# Altium schematic sheet sumo.SchDoc
size A4
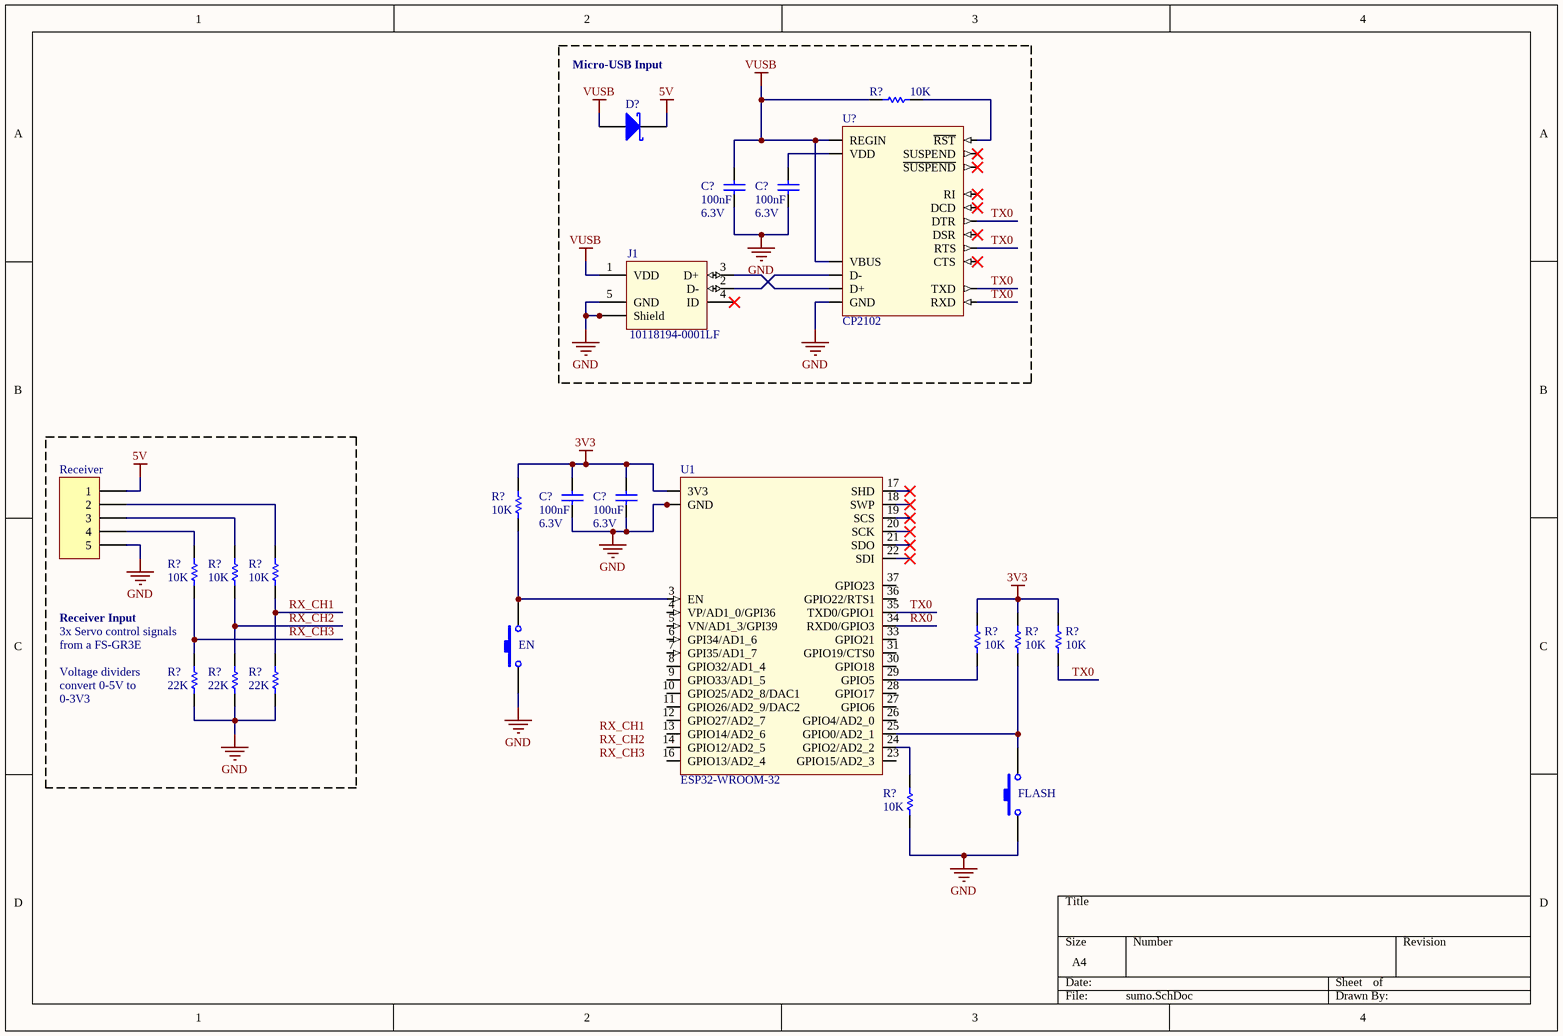
[diagram p0: sumo.SchDoc]

## Parts
(Parts that share a designator on the sheet are numbered #1, #2 ... from top to bottom, then left to right.)
C?#1  value 100nF  Voltage Rating: 6.3V  (hidden comment: Cap)
C?#2  value 100nF  Voltage Rating: 6.3V  (hidden comment: Cap)
C?#3  value 100nF  Voltage Rating: 6.3V  (hidden comment: Cap)
C?#4  value 100uF  Voltage Rating: 6.3V  (hidden comment: Cap)
D?  D Schottky  [SS14]  (value not drawn)
EN  SW-PB  [K2-1107ST-A4SW-06]  (value not drawn)
FLASH  SW-PB  [K2-1107ST-A4SW-06]  (value not drawn)
J1  10118194-0001LF  [10103594-0001LF]
R?#1  value 10K  [J1-0603]  (hidden comment: Res1)
R?#2  value 10K  [J1-0603]  (hidden comment: Res1)
R?#3  value 10K  [J1-0603]  (hidden comment: Res1)
R?#4  value 10K  [J1-0603]  (hidden comment: Res1)
R?#5  value 10K  [J1-0603]  (hidden comment: Res1)
R?#6  value 10K  [J1-0603]  (hidden comment: Res1)
R?#7  value 10K  [J1-0603]  (hidden comment: Res1)
R?#8  value 10K  [J1-0603]  (hidden comment: Res1)
R?#9  value 22K  [J1-0603]  (hidden comment: Res1)
R?#10  value 22K  [J1-0603]  (hidden comment: Res1)
R?#11  value 22K  [J1-0603]  (hidden comment: Res1)
R?#12  value 10K  [J1-0603]  (hidden comment: Res1)
Receiver  (no value)  [HDR1X5]
U1  ESP32-WROOM-32  [ESP32-WROOM-32]
U?  CP2102  [QFN-28]

## Blocks framed on the sheet
Micro-USB Input: C?#1 C?#2 D? J1 R?#1 U?

## Nets
3V3: C?#3.2 C?#4.2 R?#2.2 R?#6.2 R?#7.2 R?#8.2 U1.2(3V3)
5V: D?.2(K) Receiver.1
GND: C?#1.1 C?#2.1 C?#3.1 C?#4.1 EN.1 FLASH.1 J1.5(GND) J1.6(Shield) J1.7(Shield) J1.8(Shield) J1.9(Shield) R?#9.1 R?#10.1 R?#11.1 R?#12.1 Receiver.5 U1.1(GND) U1.15(GND) U1.38(GND) U1.39(GND) U?.3(GND)
VUSB: C?#1.2 D?.1(A) J1.1(VDD) R?#1.2 U?.7(REGIN) U?.8(VBUS)
RX0: U1.34(RXD0/GPIO3)
RX_CH1: R?#5.1 R?#11.2
RX_CH2: R?#4.1 R?#10.2
RX_CH3: R?#3.1 R?#9.2
TX0: R?#8.1 U1.35(TXD0/GPIO1) U?.24(RTS) U?.25(RXD) U?.26(TXD) U?.28(DTR)
NetC?#2_2: C?#2.2 U?.6(VDD)
NetEN_2: EN.2 R?#2.1 U1.3(EN)
NetFLASH_2: FLASH.2 R?#7.1 U1.25(GPIO0/AD2_1)
NetJ1_2: J1.2(D-) U?.5(D-)
NetJ1_3: J1.3(D+) U?.4(D+)
NetR?#1_1: R?#1.1 U?.9(~{RST})
NetR?#3_2: R?#3.2 Receiver.4
NetR?#4_2: R?#4.2 Receiver.3
NetR?#5_2: R?#5.2 Receiver.2
NetR?#6_1: R?#6.1 U1.29(GPIO5)
NetR?#12_2: R?#12.2 U1.24(GPIO2/AD2_2)

Not connected (* = marked no-connect by the designer): J1 4(ID)*; U1 4(VP/AD1_0/GPI36) 5(VN/AD1_3/GPI39) 6(GPI34/AD1_6) 7(GPI35/AD1_7) 8(GPIO32/AD1_4) 9(GPIO33/AD1_5) 10(GPIO25/AD2_8/DAC1) 11(GPIO26/AD2_9/DAC2) 12(GPIO27/AD2_7) 13(GPIO14/AD2_6) 14(GPIO12/AD2_5) 16(GPIO13/AD2_4) 17(SHD)* 18(SWP)* 19(SCS)* 20(SCK)* 21(SDO)* 22(SDI)* 23(GPIO15/AD2_3) 26(GPIO4/AD2_0) 27(GPIO6) 28(GPIO17) 30(GPIO18) 31(GPIO19/CTS0) 33(GPIO21) 36(GPIO22/RTS1) 37(GPIO23); U? 1(DCD)* 2(RI)* 11(~{SUSPEND})* 12(SUSPEND)* 23(CTS)* 27(DSR)*

## Notes on the sheet
- Receiver Input
- (near R?#9) 3x Servo control signals
- (near R?#9) from a FS-GR3E
- (near R?#9) Voltage dividers
- (near R?#9) convert 0-5V to
- 0-3V3
- Labels drawn without touching a wire or pin: RX_CH1, RX_CH2, RX_CH3

## Library data of the parts
C?#1-C?#4 = Cap: Capacitor; Published: 8-Jun-2000; LatestRevisionDate: 17-Jul-2002; LatestRevisionNote: Re-released for DXP Platform.; PackageReference: RAD-0.3; Publisher: Altium Limited; PackageDescription: Radial Cap, Thru-Hole; 2 Leads; 0.3 in Pin Spacing
D? = D Schottky: Schottky Diode; Published: 8-Jun-2000; LatestRevisionDate: 17-Jul-2002; LatestRevisionNote: Re-released for DXP Platform.; PackageReference: SMB; Publisher: Altium Limited; PackageDescription: DO-214-AA/SMB; 2 C-Bend Leads; Body 5.3 x 3.6 mm, inc. leads (LxW); Code_JEDEC: DO-214-AA; LCSC: C110213
EN FLASH = SW-PB: Switch; Published: 24-Mar-1999; LatestRevisionDate: 17-Jul-2002; LatestRevisionNote: Re-released for DXP Platform.; PackageReference: SPST-2; Publisher: Altium Limited; PackageDescription: Switch; 2 Leads; LCSC: C118141
J1 = 10118194-0001LF_1: Conn Micro USB Type B RCP 5 POS 0.65mm Solder RA SMD 5 Terminal 1 Port T/R; MF: FCI; RS: 714-2347; Availability: Good; Price: 0.23 USD; MP: 10118194-0001LF; Package: DIP-4 FCI; Value: *
R?#1-R?#12 = Res1: Resistor; Published: 8-Jun-2000; LatestRevisionDate: 17-Jul-2002; LatestRevisionNote: Re-released for DXP Platform.; PackageReference: AXIAL-0.3; Publisher: Altium Limited; PackageDescription: Axial Device, Thru-Hole; 2 Leads; 0.3 in Pin Spacing
Receiver = Header 5: Receiver Input; LatestRevisionDate: 17-Jul-2002; LatestRevisionNote: Re-released for DXP Platform.; Publisher: Altium Limited